# Altium schematic sheet JacdacMicroBitBackPackHi-Atl1 119.SchDoc: Complete design
size A4; DocumentNumber: 1; SheetNumber: 1; SheetTotal: 1; VersionControl_RevNumber: 1
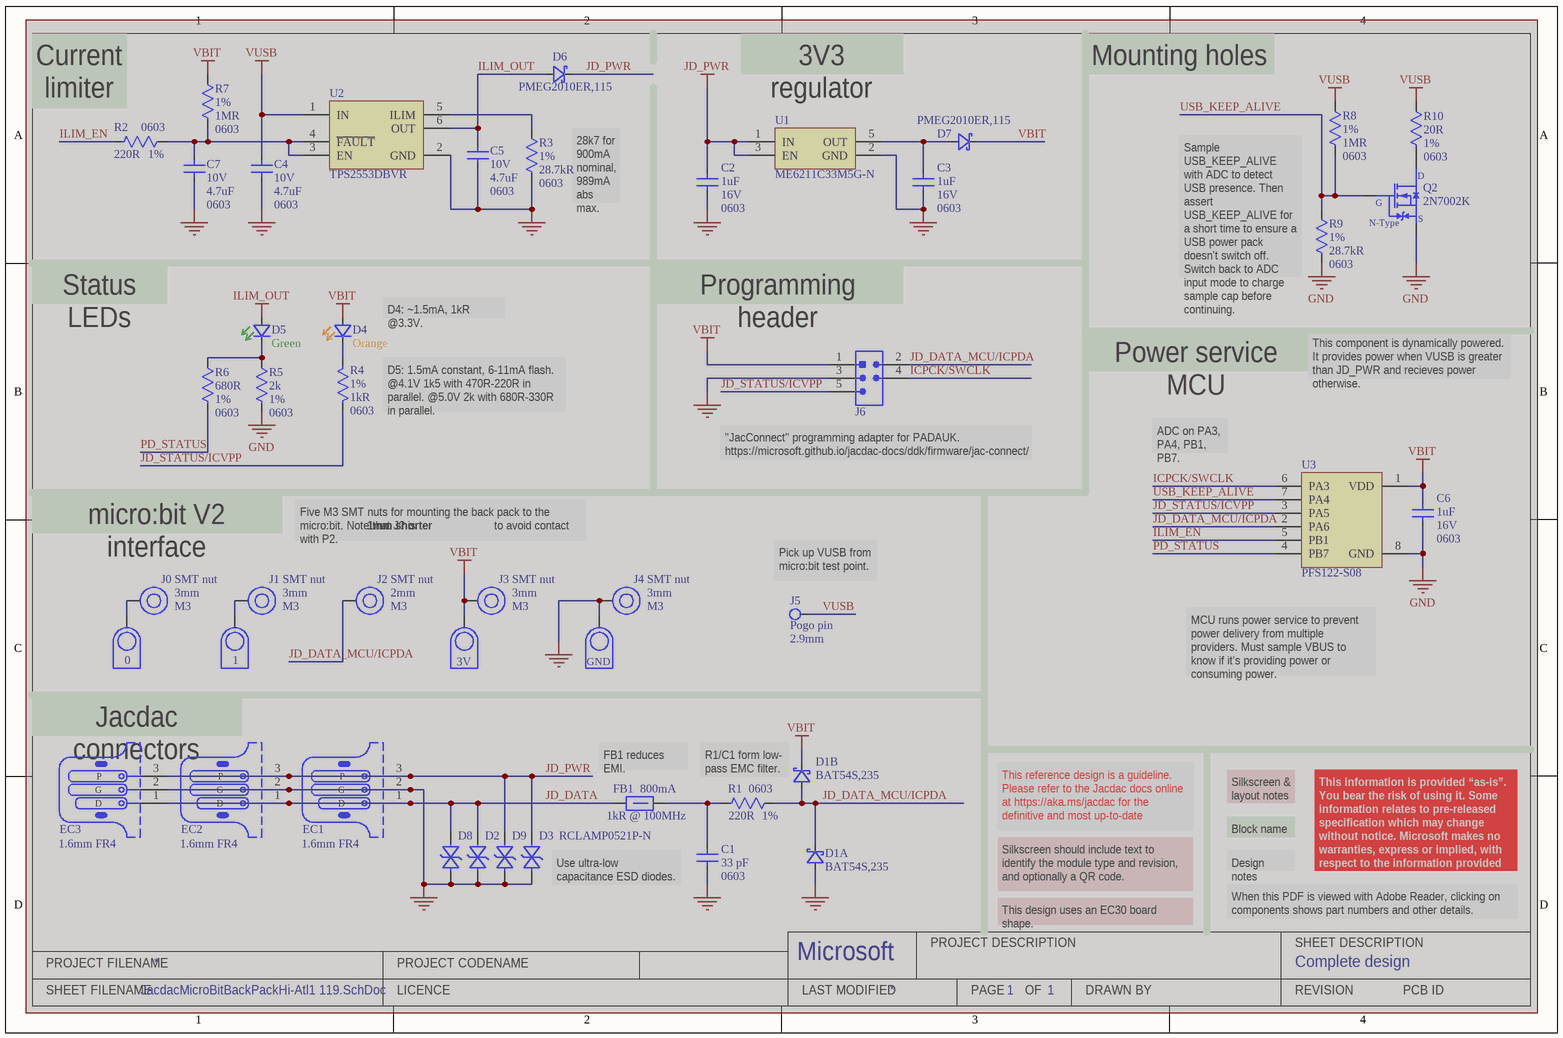
[diagram p0: JacdacMicroBitBackPackHi-Atl1 119.SchDoc]

## Parts
C1  33 pF  Case/Package: 0603  [CC0603]  (masked out: inside a compile mask, not in the netlist)
C2  Voltage: 16V  Case/Package: 0603  Capacitance: 1uF  [C0603 - without outline]  (hidden comment: 1uF 16V)  (masked out: inside a compile mask, not in the netlist)
C3  Voltage: 16V  Case/Package: 0603  Capacitance: 1uF  [C0603 - without outline]  (hidden comment: 1uF 16V)  (masked out: inside a compile mask, not in the netlist)
C4  Voltage Rating: 10V  Capacitance: 4.7uF  Case Code (Imperial): 0603  [C0603 - without outline]  (hidden comment: CL10A475KP8NNNC)  (masked out: inside a compile mask, not in the netlist)
C5  Voltage Rating: 10V  Capacitance: 4.7uF  Case Code (Imperial): 0603  [C0603 - without outline]  (hidden comment: CL10A475KP8NNNC)  (masked out: inside a compile mask, not in the netlist)
C6  Voltage: 16V  Case/Package: 0603  Capacitance: 1uF  [C0603 - without outline]  (hidden comment: 1uF 16V)  (masked out: inside a compile mask, not in the netlist)
C7  Voltage Rating: 10V  Capacitance: 4.7uF  Case Code (Imperial): 0603  [C0603 - without outline]  (hidden comment: CL10A475KP8NNNC)  (masked out: inside a compile mask, not in the netlist)
D1  Manufacturer Part Number: BAT54S,235  [NXP-BAT54S-TO-236AB - without outline]  (hidden comment: BAT54S)  (parts A,B of 2)  (masked out: inside a compile mask, not in the netlist)
D2  RCLAMP0521P-N  [TVS 0402 - XL]  (value not drawn)  (masked out: inside a compile mask, not in the netlist)
D3  RCLAMP0521P-N  [TVS 0402 - XL]  (masked out: inside a compile mask, not in the netlist)
D4  Colour: Orange  [0603 Orange]  (hidden comment: 19-217/S2C-AQ1R1B/3T)  (masked out: inside a compile mask, not in the netlist)
D5  Colour: Green  [0603 Green]  (hidden comment: 19-217/GHC-YR1S2/3T)  (masked out: inside a compile mask, not in the netlist)
D6  PMEG2010ER,115  [SOD-123W]  (masked out: inside a compile mask, not in the netlist)
D7  PMEG2010ER,115  [SOD-123W]  (masked out: inside a compile mask, not in the netlist)
D8  RCLAMP0521P-N  [TVS 0402 - XL]  (value not drawn)  (masked out: inside a compile mask, not in the netlist)
D9  RCLAMP0521P-N  [TVS 0402 - XL]  (value not drawn)  (masked out: inside a compile mask, not in the netlist)
EC1  PCB Type: 1.6mm FR4  [JACDAC_EDGE_CONNECTOR_NO_TRACES]  (hidden comment: 3 pin JACDAC edge connector)  (no BOM)  (masked out: inside a compile mask, not in the netlist)
EC2  PCB Type: 1.6mm FR4  [JACDAC_EDGE_CONNECTOR_NO_TRACES]  (hidden comment: 3 pin JACDAC edge connector)  (no BOM)  (masked out: inside a compile mask, not in the netlist)
EC3  PCB Type: 1.6mm FR4  [JACDAC_EDGE_CONNECTOR_NO_TRACES]  (hidden comment: 3 pin JACDAC edge connector)  (no BOM)  (masked out: inside a compile mask, not in the netlist)
FB1  Current Rating: 800mA  Impedance: 1kR @ 100MHz  [TDK MPZ1608 0.8mm - without outline]  (hidden comment: TDK MPZ1608S102ATA00)  (masked out: inside a compile mask, not in the netlist)
J0  SMT nut  Standoff Height: 3mm  Diameter: M3  [SMTSO-M3-3ET]  (masked out: inside a compile mask, not in the netlist)
J1  SMT nut  Standoff Height: 3mm  Diameter: M3  [SMTSO-M3-3ET]  (masked out: inside a compile mask, not in the netlist)
J2  SMT nut  Standoff Height: 2mm  Diameter: M3  [SMTSO-M3-2ET]  (masked out: inside a compile mask, not in the netlist)
J3  SMT nut  Standoff Height: 3mm  Diameter: M3  [SMTSO-M3-3ET]  (masked out: inside a compile mask, not in the netlist)
J4  SMT nut  Standoff Height: 3mm  Diameter: M3  [SMTSO-M3-3ET]  (masked out: inside a compile mask, not in the netlist)
J5  Pogo pin  Working Height: 2.9mm  [HARWIN-P70-1000045R]  (masked out: inside a compile mask, not in the netlist)
J6  Hack Connect Mini 1.27 mm pitch 2-row  [HACK_CONNECT_MINI_5_X_1_27_0.559mm_TH]  (value not drawn)  (no BOM)  (masked out: inside a compile mask, not in the netlist)
J10  micro:bit ring hole  [Microbit_V2_Edge_Connector_Ring_P0]  (value not drawn)  (no BOM)  (masked out: inside a compile mask, not in the netlist)
J11  micro:bit ring hole  [Microbit_V2_Edge_Connector_Ring_P1]  (value not drawn)  (no BOM)  (masked out: inside a compile mask, not in the netlist)
J13  micro:bit ring hole  [Microbit_V2_Edge_Connector_Ring_GND]  (value not drawn)  (no BOM)  (masked out: inside a compile mask, not in the netlist)
J14  micro:bit ring hole  [Microbit_V2_Edge_Connector_Ring_3V]  (value not drawn)  (no BOM)  (masked out: inside a compile mask, not in the netlist)
Q2  2N7002K  [SOT23-ONS]  (masked out: inside a compile mask, not in the netlist)
R1  Tolerance: 1%  Case/Package: 0603  [RC0603]  (hidden comment: 220R)  (masked out: inside a compile mask, not in the netlist)
R2  Tolerance: 1%  Case/Package: 0603  [RC0603]  (hidden comment: 220R)  (masked out: inside a compile mask, not in the netlist)
R3  Tolerance: 1%  Resistance: 28.7kR  Case/Package: 0603  [RC0603]  (hidden comment: 28.7k)  (masked out: inside a compile mask, not in the netlist)
R4  Tolerance: 1%  Resistance: 1kR  Case/Package: 0603  [RC0603]  (hidden comment: 1k)  (masked out: inside a compile mask, not in the netlist)
R5  2k  Tolerance: 1%  Case/Package: 0603  [RC0603-M]  (masked out: inside a compile mask, not in the netlist)
R6  680R  Tolerance: 1%  Case/Package: 0603  [RC0603-M]  (masked out: inside a compile mask, not in the netlist)
R7  Tolerance: 1%  Resistance: 1MR  Case/Package: 0603  [RC0603-M]  (hidden comment: 1M)  (masked out: inside a compile mask, not in the netlist)
R8  Tolerance: 1%  Resistance: 1MR  Case/Package: 0603  [RC0603-M]  (hidden comment: 1M)  (masked out: inside a compile mask, not in the netlist)
R9  Tolerance: 1%  Resistance: 28.7kR  Case/Package: 0603  [RC0603]  (hidden comment: 28.7k)  (masked out: inside a compile mask, not in the netlist)
R10  Resistance: 20R  Tolerance: 1%  Case Code (Imperial): 0603  [RC0603]  (hidden comment: RC0603FR-0720RL)  (masked out: inside a compile mask, not in the netlist)
U1  ME6211C33M5G-N  [MICRONE-SOT23-5]  (masked out: inside a compile mask, not in the netlist)
U2  TPS2553DBVR  [TI-TPS2553 - without_outline]  (masked out: inside a compile mask, not in the netlist)
U3  PFS122-S08  [SOP-8]  (masked out: inside a compile mask, not in the netlist)

## Notes on the sheet
- (near R2) Current limiter
- 3V3 regulator
- Mounting holes
- 28k7 for 900mA nominal,
  989mA abs max.
- Status LEDs
- D4: ~1.5mA, 1kR @3.3V.
- Programming header
- Sample USB_KEEP_ALIVE with ADC to detect USB presence. Then assert USB_KEEP_ALIVE for a short time to ensure a USB power pack doesn't switch off. Switch back to ADC input mode to charge sample cap before continuing.
- Power service MCU
- This component is dynamically powered. It provides power when VUSB is greater than JD_PWR and recieves power otherwise.
- D5: 1.5mA constant, 6-11mA flash. @4.1V 1k5 with 470R-220R in parallel. @5.0V 2k with 680R-330R in parallel.
- ADC on PA3, PA4, PB1, PB7.
- (near J6) "JacConnect" programming adapter for PADAUK.
  https://microsoft.github.io/jacdac-docs/ddk/firmware/jac-connect/
- micro:bit V2 interface
- Five M3 SMT nuts for mounting the back pack to the micro:bit. Note that J? is                         to avoid contact with P2.
- 1mm shorter
- (near J5) Pick up VUSB from micro:bit test point.
- MCU runs power service to prevent power delivery from multiple providers. Must sample VBUS to know if it's providing power or consuming power.
- Jacdac connectors
- (near FB1) FB1 reduces EMI.
- (near D1) R1/C1 form low- pass EMC filter.
- This reference design is a guideline. Please refer to the Jacdac docs online at https://aka.ms/jacdac for the definitive and most up-to-date information.
- Block name
- Silkscreen & layout notes
- Use ultra-low capacitance ESD diodes.
- This design uses an EC30 board shape.
- Silkscreen should include text to identify the module type and revision, and optionally a QR code.
- D1 clamps JD_DATA to protect MCU.
- Design notes
- When this PDF is viewed with Adobe Reader, clicking on components shows part numbers and other details.
- This information is provided “as-is”. You bear the risk of using it. Some information relates to pre-released specification which may change without notice. Microsoft makes no warranties, express or implied, with respect to the information provided here.
- PROJECT FILENAME
- PROJECT CODENAME
- Microsoft
- PROJECT DESCRIPTION
- SHEET DESCRIPTION
- SHEET FILENAME
- LICENCE
- LAST MODIFIED
- PAGE
- OF
- DRAWN BY
- REVISION
- PCB ID
- (in symbol 2N7002K) N-Type
- (in symbol micro:bit edge connector ring 3V) 3V
- (in symbol micro:bit edge connector ring GND) GND
- (in symbol micro:bit edge connector ring P0) 0

## Library data of the parts
C1 = CC0603JRNPO9BN330: 33pF 0603 100V C0G/NPO; Manufacturer: Yageo; Dielectric: C0G; Tolerance: 5%; Supplier 1: Digi-Key; Manufacturer Part Number: CC0603JRNPO9BN330; RoHS: Yes; Category: Ceramic Capacitors; Mount: Surface Mount; Weight: 7.1E-05oz; Case Code (Imperial): 0603; Case Code (Metric): 1608; Min Operating Temperature: -55°C; Max Operating Temperature: 125°C; Capacitance: 33pF; Termination: SMD/SMT; Composition: Ceramic; Packaging: Tape and Reel; Voltage Rating: 100V; Voltage Rating (DC): 100V; Length: 1.6mm; Height: 0.8mm; Thickness: 0.035inch; Depth: 0.8mm; Width: 0.8mm; Lead Free: Lead Free; ComponentLink1URL: https://datasheet.ciiva.com/13207/upy-gp-np0-16v-to-50v-8-13207786.pdf; ComponentLink1Description: Online datasheet; Manufacturer 1: Yageo; Manufacturer Part Number 1: CC0603JRNPO9BN330
C2 C3 C6 = CL10A105KO8NNNC: SMD Multilayer Ceramic Capacitor, 1 µF, 16 V, 0603 [1608 Metric], ± 10%, X5R, CL Series; Manufacturer: Samsung; ComponentLink1URL: https://datasheet.lcsc.com/lcsc/1811021622_Samsung-Electro-Mechanics-CL10A105KO8NNNC_C1592.pdfq; ComponentLink1Description: Online datasheet; Supplier 1: Digi-Key; Manufacturer Part Number: CL10A105KO8NNNC; RoHS: Yes; Category: Ceramic Capacitors; Stock 1: 3575337; Pricing 1: 1=0.10000, 10=0.03600, 50=0.01960, 100=0.01600, 500=0.01144, 1000=0.00898 (USD); Mount: Surface Mount; Case Code (Metric): 1608; Case Code (Imperial): 0603; Material: Ceramic; Contact Plating: Tin; Min Operating Temperature: -55°C; Max Operating Temperature: 85°C; Tolerance: 10%; Package Quantity: 1; Packaging: Tape and Reel; Voltage Rating: 16V; Dielectric: X5R; Voltage Rating (DC): 16V; Series: CL; Construction: Flat; Length: 1.6mm; Width: 0.031inch; Height: 0.8mm; Thickness: 0.035inch; Depth: 0.8mm; Radiation Hardening: No; Lead Free: Lead Free; RoHS Compliant: Yes; Supplier 2: Farnell; Supplier 3: RSComponents; Supplier 4: Mouser; Supplier Part Number 1: 1276-1034-1-ND; Supplier Part Number 2: 3013384; Supplier Part Number 3: 7664780; Supplier Part Number 4: 187-CL10A105KO8NNNC; Supplier 5: LCSC; Supplier Part Number 5: C1592; Manufacturer 1: Samsung; Manufacturer Part Number 1: CL10A105KO8NNNC
C4 C5 C7 = CL10A475KP8NNNC: CAP CER 4.7UF 10V X5R 0603; Manufacturer: Samsung; Tolerance: 10%; Supplier 1: Farnell; Manufacturer Part Number: CL10A475KP8NNNC; RoHS: Yes; Category: Ceramic Capacitors; Stock 1: 75690; Pricing 1: 10=0.02700, 100=0.02160, 500=0.01580, 1000=0.01310, 2000=0.01130 (GBP); Mount: Surface Mount; Case/Package: 0603; Case Code (Metric): 1608; Contact Plating: Tin; Min Operating Temperature: -55°C; Max Operating Temperature: 85°C; Dielectric: X5R; Package Quantity: 1; Packaging: Tape and Reel; Series: CL; Construction: Flat; Length: 1.6mm; Width: 0.031inch; Height: 0.8mm; Thickness: 0.035inch; Depth: 0.8mm; Radiation Hardening: No; RoHS Compliant: Yes; ComponentLink1URL: https://datasheet.ciiva.com/25797/cl10a475kp8nnnc-25797520.pdf; ComponentLink1Description: Online datasheet; Supplier 2: Digi-Key; Pricing 2: 1=0.10000, 10=0.04900, 50=0.02680, 100=0.02180, 500=0.01558, 1000=0.01224 (USD); Supplier Part Number 2: 1276-1044-1-ND; Supplier Part Number 1: 3013398; Created By: D Gakure; Checked By: ?
D1 = BAT54S: DIODE ARRAY SCHOTTKY 30V SOT23; Manufacturer: Nexperia; Supplier 1: Digi-Key; RoHS: No; Category: Rectifier Diodes; Stock 1: 14011; Pricing 1: 1=0.13000, 10=0.11900, 100=0.05610, 500=0.03326, 1000=0.02185, 5000=0.02138 (USD); ComponentLink1URL: https://assets.nexperia.com/documents/data-sheet/BAT54_SER.pdf; ComponentLink1Description: NXP datasheet online; Supplier 2: Mouser; Supplier 3: RSComponents; Supplier Part Number 2: 771-BAT54S235; Supplier Part Number 3: 1707990; Supplier Part Number 1: 1727-1868-1-ND; Manufacturer 1: Nexperia; Manufacturer Part Number 1: BAT54S,235
D2 D3 D8 D9 = RCLAMP0521P-N: Bidirectional 5V (Max) 6V 16V 3.5A (8/20us) 0402 TVS RoHS; Manufacturer: Born Semiconductor; Package: 0402; Created By: D Gakure; Checked By: ?; Supplier1: LCSC; Supplier1 Part Number: C316043; ComponentLink1Description: Online datasheet; ComponentLink1URL: https://datasheet.lcsc.com/szlcsc/Bourne-Semicon-Shenzhen-RCLAMP0521P-N_C316043.pdf; Manufacturer Part Number: RCLAMP0521P-N; Manufacturer 1: Born Semiconductor; Manufacturer Part Number 1: RCLAMP0521P-N
D4 = 19-217/S2C-AQ1R1B/3T: LED ORANGE DIFFUSED 0603 SMD; Manufacturer: Everlight Elec; Manufacturer Part Number: 19-217/S2C-AQ1R1B/3T; Mount: Surface Mount; Case/Package: 0603; Color: Orange; Case Code (Imperial): 0603; ComponentLink1URL: https://datasheet.lcsc.com/lcsc/1912171731_Everlight-Elec-19-217-S2C-AQ1R1B-3T_C146215.pdf; ComponentLink1Description: Online datasheet; Supplier 1: LCSC; Supplier 1 Part Number: C146215
D5 = 19-217/GHC-YR1S2/3T: LED GREEN DIFFUSED 0603 SMD; Manufacturer: Everlight Elec; Manufacturer Part Number: 19-217/GHC-YR1S2/3T; Mount: Surface Mount; Case/Package: 0603; Color: Green; Case Code (Imperial): 0603; ComponentLink1URL: https://datasheet.lcsc.com/lcsc/1811101510_Everlight-Elec-19-217-GHC-YR1S2-3T_C72043.pdf; ComponentLink1Description: Online datasheet; Supplier 1: LCSC; Supplier 1 Part Number: C72043
D6 D7 = PMEG2010ER,115: NEXPERIA - PMEG2010ER,115 - DIODE, RECT SCH, 20V, 1A, SOD123W; Supplier 1: Digi-Key; Manufacturer: Nexperia; RoHS: Yes; Stock 1: 722; Pricing 1: 1=0.42000, 10=0.31300, 100=0.19480, 500=0.13328, 1000=0.10252 (USD); RoHS Compliant: Yes; ComponentLink1URL: http://www.farnell.com/datasheets/1383341.pdf; ComponentLink1Description: Online datasheet; Supplier 2: Future Electronics; Stock 2: 144000; Pricing 2: 3000=0.20000, 6000=0.16300, 9000=0.16200, 12000=0.16100, 15000=0.16000 (USD); Supplier 3: RSComponents; Stock 3: 1; Pricing 3: 50=0.32100, 100=0.26700, 250=0.21200, 500=0.11100, 1000=0.08200 (USD); Supplier 4: Mouser; Stock 4: 2146; Pricing 4: 1=0.37000, 10=0.25700, 50=0.25700, 100=0.13400, 1000=0.09400, 10000=0.07200 (USD); Supplier 5: Farnell; Stock 5: 24250; Pricing 5: 5=0.40400, 10=0.27600, 100=0.13400, 500=0.11500, 1000=0.07750 (GBP); Supplier Part Number 5: 1907681; Supplier Part Number 4: 771-PMEG2010ER115; Supplier Part Number 3: 8166824P; Supplier Part Number 2: 4222907; Supplier Part Number 1: 1727-5192-1-ND; Manufacturer Part Number: PMEG2010ER,115
EC1-EC3 = Jacdac edge connector: 3 pin Jacdac edge connector 1.27mm pitch; Manufacturer Part Number: JACDAC_EDGE_CONNECTOR; Checked By: ?; Created By: D. Gakure; ComponentLink1Description: Yuliang JACDAC cable connector drawing online; ComponentLink1URL: https://github.com/microsoft/jacdac-mdk/blob/main/connector/JACDAC-Connector-by-Yuliang-2020-11-28.pdf; ComponentLink2Description: JACDAC PCB edge connector spec onlin; ComponentLink2URL: https://github.com/microsoft/jacdac-mdk/blob/main/connector/JACDAC_PCB_Edge_Connector_Drawing_JD-PEC-01_rev_01.pdf
FB1 = TDK MPZ1608S102ATA00: 0603 1k@100MHz 0.8A chip; Core Material: Ferrite; Tolerance: 25%; DC Resistance (DCR): 300mR; Supplier 1: Digi-Key; Stock 1: 113542; Pricing 1: 1=0.1, 10=0.079, 25=0.0716, 50=0.0644, 100=0.0472, 250=0.03432, 500=0.03146, 1000=0.02717 (USD); Mount: Surface Mount; Case/Package: 0603; Case Code (Metric): 1608; Case Code (Imperial): 0603; Package Quantity: 4000; Packaging: Tape and Reel; Max DC Current: 800mA; Length: 0.063inch; Height: 0.037inch; Width: 0.031inch; ComponentLink2URL: https://www.mouser.co.uk/datasheet/2/400/eads_commercial_power_mpz1608_en-923650.pdf; ComponentLink2Description: datasheet online; Supplier 2: Mouser; ComponentLink3Description: datasheet; ComponentLink3URL: Y:\System\Altium\Libraries 2014\TDK\Datasheets\eads_commercial_power_mpz1608_en-923650.pdf; Supplier Part Number 1: 445-8694-1-ND; Supplier Part Number 2: 810-MPZ1608S102ATA00; Manufacturer: TDK; Manufacturer Part Number: MPZ1608S102ATA00; Manufacturer 1: TDK; Manufacturer Part Number 1: MPZ1608S102ATA00
J0 J1 J3 J4 = SMTSO-M3-3ET: Standoff Round Swage F/F M3 X 0.5-THD Carbon Steel Electro-Tin ASTM B545 Automotive; Manufacturer 1: PennEngineering; Supplier 1: Mouser; Manufacturer Part Number 1: SMTSO-M3-3ET; RoHS: No; Supplier Part Number 1: 153-SMTSO-M3-3ET; Manufacturer: PennEngineering; Manufacturer Part Number: SMTSO-M3-3ET
J2 = SMTSO-M3-2ET: Standoff Round Swage F/F M3 X 0.5-THD Carbon Steel Electro-Tin ASTM B545 Automotive; Manufacturer 1: PennEngineering; Supplier 1: Mouser; Manufacturer Part Number 1: SMTSO-M3-2ET; RoHS: No; Supplier Part Number 1: 153-SMTSO-M3-2ET; Manufacturer: PennEngineering; Manufacturer Part Number: SMTSO-M3-2ET
J5 = HARWIN-P70-1000045R: Spring Loaded Contact, Pin, 2.9mm, SMT; Manufacturer 1: Harwin; Plating: Gold; Current Rating: 2A; Supplier 1: Digi-Key; Manufacturer Part Number 1: P70-1000045R; RoHS: Yes; Category: Connectors; Stock 1: 1152; Pricing 1: 1=1.02000, 10=0.85900, 25=0.82400, 50=0.80660, 100=0.77150, 250=0.70140, 500=0.63126 (USD); Mount: Surface Mount; Material: Brass; REACH SVHC: No SVHC; RoHS Compliant: Yes; ComponentLink1URL: https://cdn.harwin.com/pdfs/P70-10X.pdf; ComponentLink1Description: Harwin drawing online; ComponentLink2URL: http://www.farnell.com/datasheets/2151575.pdf; ComponentLink2Description: Harwin catalogue page online; Manufacturer Part Number: P70-1000045R; Manufacturer: Harwin; Supplier Part Number 1: 952-3127-1-ND; Supplier 2: Farnell; Supplier 3: Mouser; Supplier Part Number 2: 2664910; Supplier Part Number 3: 855-P70-1000045R; Length: 3.5mm
J6 = HACK_CONNECT_MINI
J10 = micro:bit edge connector ring P0: One ring like those on the micro:bit edge connector, designed to take a 4mm banana plug
J11 = micro:bit edge connector ring P1: One ring like those on the micro:bit edge connector, designed to take a 4mm banana plug
J13 = micro:bit edge connector ring GND: One ring like those on the micro:bit edge connector, designed to take a 4mm banana plug
J14 = micro:bit edge connector ring 3V: One ring like those on the micro:bit edge connector, designed to take a 4mm banana plug
Q2 = 2N7002K: MOSFET Transistor, N Channel, 300 mA, 60 V, 2 ohm, 10 V, 2.5 V; Manufacturer: ON Semiconductor / Fairchild; Max Power Dissipation: 350mW; Continuous Drain Current (ID): 300mA; Input Capacitance: 50pF; Number of Elements: 1; Rds On Max: 2R; Drain to Source Breakdown Voltage: 60V; Threshold Voltage: 2.5V; Element Configuration: Single; Gate to Source Voltage (Vgs): 20V; Turn-Off Delay Time: 30ns; Turn-On Delay Time: 5ns; Polarity: N-CHANNEL; Supplier 1: Digi-Key; Stock 1: 53564; Pricing 1: 1=0.40000, 10=0.32500, 25=0.27240, 100=0.17240, 500=0.11344, 1000=0.07714 (USD); Case/Package: SOT-23; Number of Pins: 3; Contact Plating: Tin,Matte; Min Operating Temperature: -55°C; Max Operating Temperature: 150°C; Packaging: Tape and Reel; Power Dissipation: 350mW; Package Quantity: 1; Drain to Source Resistance: 2R; On-State Resistance: 2R; Length: 2.92mm; Height: 1.2mm; Width: 1.3mm; Radiation Hardening: No; Lead Free: Lead Free; REACH SVHC: No SVHC; Supplier 2: Mouser; ComponentLink1Description: Online datasheet; ComponentLink1URL: https://www.onsemi.com/pdf/datasheet/2n7002k-d.pdf; Supplier Part Number 2: 512-2N7002K; Supplier Part Number 1: 2N7002KCT-ND; Manufacturer Part Number: 2N7002K; Supplier 3: Farnell; Supplier Part Number 3: 2453382; Category: MOSFETs; Checked By: ?; Created By: D. Gakure; Drain-source On Resistance-Max: 2R; Drain to Source Voltage (Vdss): 60V; Mount: Surface Mount; Pricing 2: 1=0.40000, 10=0.27300, 50=0.27300, 100=0.13400, 1000=0.07800, 10000=0.05100 (USD); Pricing 3: 5=0.34800, 10=0.23500, 100=0.09100, 500=0.05850, 3000=0.04630, 9000=0.03860, 24000=0.03750, 45000=0.03530 (GBP); RoHS: Yes; Stock 2: 111825; Stock 3: 101059; Voltage: 60V
R1 R2 = RC0603FR-07220RL: Res Thick Film 0603 220 Ohm 1% 0.1W(1/10W) ±100ppm/°C Pad SMD T/R; Manufacturer 1: Yageo; Voltage Rating (DC): 50V; Power Rating: 100mW; ComponentLink4URL: https://datasheet.ciiva.com/46395/443971-46395002.pdf; ComponentLink4Description: online datasheet; Supplier 1: Digi-Key; Manufacturer Part Number 1: RC0603FR-07220RL; RoHS: Yes; Category: Chip SMD Resistors; Stock 1: 1257522; Pricing 1: 1=0.10000, 10=0.02300, 100=0.00930, 1000=0.00417, 2500=0.00362 (USD); Number of Pins: 2; Case Code (Imperial): 0603; Case Code (Metric): 1608; Size Code: 0603; Min Operating Temperature: -55°C; Max Operating Temperature: 155°C; Resistor Type: Thick Film; Temperature Coefficient: 100ppm/°C; Packaging: Tape and Reel; Voltage Rating: 50V; Package Quantity: 1; Termination: SMD/SMT; Number of Terminations: 2; Max Power Dissipation: 100mW; Features: Moisture Resistant; Series: RC; Resistance Tolerance: 1%; Construction: Rectangular; Length: 1.6mm; Width: 0.031inch; Height: 0.022inch; Depth: 0.8mm; REACH SVHC: No SVHC; Lead Free: Lead Free; RoHS Compliant: Yes; Military Standard: Not; Supplier 2: Farnell; Supplier 3: Mouser; Supplier 4: RSComponents; Supplier Part Number 2: 2421863; Supplier Part Number 3: 603-RC0603FR-07220RL; Supplier Part Number 4: 1995497; Supplier Part Number 1: 311-220HRCT-ND; Manufacturer: Yageo; Manufacturer Part Number: RC0603FR-07220RL; Resistance: 220R
R3 R9 = RC0603FR-0728K7L: Res Thick Film 0603 28.7k Ohm 1% 0.1W(1/10W) ±100ppm/C Pad SMD T/R; Manufacturer 1: Yageo; Voltage Rating: 50V; Power Rating: 100mW; Temperature Coefficient: 100ppm/°C; Supplier 1: Digi-Key; Manufacturer Part Number 1: RC0603FR-0728K7L; RoHS: Yes; Category: Chip SMD Resistors; Stock 1: 276730; Pricing 1: 1=0.10000, 10=0.02300, 100=0.00930, 1000=0.00417, 2500=0.00362 (USD); Mount: Surface Mount; Case Code (Imperial): 0603; Case Code (Metric): 1608; Size Code: 0603; Min Operating Temperature: -55°C; Max Operating Temperature: 155°C; Packaging: Tape and Reel; Package Quantity: 1; Resistor Type: Thick Film; Termination: SMD/SMT; Number of Terminations: 2; Max Power Dissipation: 100mW; Voltage Rating (DC): 50V; Features: Moisture Resistant; Series: RC; Construction: Rectangular; Technology: THICK FILM; Length: 1.6mm; Width: 0.031inch; Height: 0.022inch; Depth: 0.8mm; Military Standard: Not; Lead Free: Lead Free; RoHS Compliant: Yes; ComponentLink5URL: https://datasheet.ciiva.com/2553/pyu-r-int-thick-7-2553533.pdf; ComponentLink5Description: onilne datasheet; Manufacturer: Yageo; Manufacturer Part Number: RC0603FR-0728K7L; Supplier 2: Farnell; Supplier 3: Mouser; Supplier 4: RSComponents; Supplier Part Number 1: 311-28.7KHRCT-ND; Supplier Part Number 2: 3951071; Supplier Part Number 3: 603-RC0603FR-0728K7L; Supplier Part Number 4: 505-1003
R4 = RC0603FR-071KL: Res Thick Film 0603 1K Ohm 1% 1/10W ±100ppm/°C Molded SMD SMD Paper T/R; Manufacturer: Yageo; Power Rating: 100mW; Voltage Rating: 50V; ComponentLink4URL: https://datasheet.ciiva.com/46395/443971-46395002.pdf; ComponentLink4Description: online datasheet; Manufacturer Part Number: RC0603FR-071KL; Supplier 1: Digi-Key; Manufacturer 1: Yageo; Manufacturer Part Number 1: RC0603FR-071KL; RoHS: Yes; Category: Chip SMD Resistors; Stock 1: 7298696; Pricing 1: 1=0.10000, 10=0.02300, 100=0.00930, 1000=0.00417, 2500=0.00362 (USD); Contact Plating: Tin,Matte; Case Code (Imperial): 0603; Case Code (Metric): 1608; Size Code: 0603; Min Operating Temperature: -55°C; Max Operating Temperature: 155°C; Temperature Coefficient: 100ppm/°C; Resistor Type: Thick Film; Packaging: Tape and Reel; Termination: SMD/SMT; Features: Moisture Resistant; Series: RC; Max Power Dissipation: 100mW; Number of Terminations: 2; Technology: THICK FILM; Resistance Tolerance: 1%; Construction: Rectangular; Length: 1.6mm; Height: 0.45mm; Depth: 0.8mm; Radiation Hardening: No; REACH SVHC: No SVHC; Lead Free: Lead Free; Military Standard: Not; RoHS Compliant: Yes; Supplier 2: Farnell; Supplier 3: Mouser; Supplier 4: RSComponents; Supplier Part Number 1: 311-1.00KHRCT-ND; Supplier Part Number 2: 2421849; Supplier Part Number 3: 603-RC0603FR-071KL; Supplier Part Number 4: 1995478
R5 = RC0603FR-072KL: Res Thick Film 0603 2k Ohm 1% 0.1W(1/10W) ±100ppm/C Pad SMD T/R; Manufacturer 1: Yageo; Voltage Rating: 50V; Power Rating: 100mW; Temperature Coefficient: 100ppm/°C; Resistance: 2kR; Manufacturer Part Number 1: RC0603FR-072KL; RoHS: Yes; Category: Chip SMD Resistors; Mount: Surface Mount; Case Code (Imperial): 0603; Case Code (Metric): 1608; Size Code: 0603; Min Operating Temperature: -55°C; Max Operating Temperature: 155°C; Packaging: Tape and Reel; Package Quantity: 1; Resistor Type: Thick Film; Termination: SMD/SMT; Number of Terminations: 2; Max Power Dissipation: 100mW; Voltage Rating (DC): 50V; Features: Moisture Resistant; Series: RC; Construction: Rectangular; Technology: THICK FILM; Length: 1.6mm; Width: 0.031inch; Height: 0.022inch; Depth: 0.8mm; Military Standard: Not; Lead Free: Lead Free; RoHS Compliant: Yes; ComponentLink5URL: https://datasheet.ciiva.com/2553/pyu-r-int-thick-7-2553533.pdf; ComponentLink5Description: onilne datasheet; Manufacturer: Yageo; Manufacturer Part Number: RC0603FR-072KL; Supplier 1: Digi-Key; Supplier 2: Farnell; Supplier 3: Mouser; Supplier 4: RSComponents; Supplier Part Number 1: 311-2.00KHRCT-ND; Supplier Part Number 2: 3495801; Supplier Part Number 3: 603-RC0603FR-072KL; Supplier Part Number 4: 1995524
R6 = RC0603FR-07680RL: Res Thick Film 0603 680 Ohm 1% 0.1W(1/10W) ±100ppm/C Pad SMD T/R; Manufacturer 1: Yageo; Voltage Rating: 50V; Power Rating: 100mW; Temperature Coefficient: 100ppm/°C; Manufacturer Part Number 1: RC0603FR-07680RL; RoHS: Yes; Category: Chip SMD Resistors; Mount: Surface Mount; Case Code (Imperial): 0603; Case Code (Metric): 1608; Size Code: 0603; Min Operating Temperature: -55°C; Max Operating Temperature: 155°C; Packaging: Tape and Reel; Package Quantity: 1; Resistor Type: Thick Film; Termination: SMD/SMT; Number of Terminations: 2; Max Power Dissipation: 100mW; Voltage Rating (DC): 50V; Features: Moisture Resistant; Series: RC; Construction: Rectangular; Technology: THICK FILM; Length: 1.6mm; Width: 0.031inch; Height: 0.022inch; Depth: 0.8mm; Military Standard: Not; Lead Free: Lead Free; RoHS Compliant: Yes; ComponentLink5URL: https://datasheet.ciiva.com/2553/pyu-r-int-thick-7-2553533.pdf; ComponentLink5Description: onilne datasheet; Manufacturer: Yageo; Manufacturer Part Number: RC0603FR-07680RL; Supplier 1: Digi-Key; Supplier 2: Farnell; Supplier 3: Mouser; Supplier 4: RSComponents; Supplier Part Number 1: 311-680HRCT-ND; Supplier Part Number 2: 9238468; Supplier Part Number 3: 603-RC0603FR-07680RL; Supplier Part Number 4: 1995618; Resistance: 680R
R7 R8 = RC0603FR-071ML: Res Thick Film 0603 1M Ohm 1% 0.1W(1/10W) ±100ppm/C Pad SMD T/R; Manufacturer 1: Yageo; Voltage Rating: 50V; Power Rating: 100mW; Temperature Coefficient: 100ppm/°C; Manufacturer Part Number 1: RC0603FR-071ML; RoHS: Yes; Category: Chip SMD Resistors; Mount: Surface Mount; Case Code (Imperial): 0603; Case Code (Metric): 1608; Size Code: 0603; Min Operating Temperature: -55°C; Max Operating Temperature: 155°C; Packaging: Tape and Reel; Package Quantity: 1; Resistor Type: Thick Film; Termination: SMD/SMT; Number of Terminations: 2; Max Power Dissipation: 100mW; Voltage Rating (DC): 50V; Features: Moisture Resistant; Series: RC; Construction: Rectangular; Technology: THICK FILM; Length: 1.6mm; Width: 0.031inch; Height: 0.022inch; Depth: 0.8mm; Military Standard: Not; Lead Free: Lead Free; RoHS Compliant: Yes; ComponentLink5URL: https://datasheet.ciiva.com/2553/pyu-r-int-thick-7-2553533.pdf; ComponentLink5Description: onilne datasheet; Manufacturer: Yageo; Manufacturer Part Number: RC0603FR-071ML; Supplier 1: Digi-Key; Supplier 2: Farnell; Supplier 3: Mouser; Supplier 4: RSComponents; Supplier Part Number 4: 1995481; Supplier Part Number 3: 603-RC0603FR-071ML; Supplier Part Number 2: 9238840; Supplier Part Number 1: 311-1.00MHRCT-ND
R10 = RC0603FR-0720RL: RES SMD 20 OHM 1% 1/10W 0603; Manufacturer: Yageo; Power Rating: 100mW; Voltage Rating: 50V; Temperature Coefficient: 100ppm/°C; Working Voltage: 75V; Supplier 1: Digi-Key; Manufacturer Part Number: RC0603FR-0720RL; RoHS: Yes; Category: Chip SMD Resistors; Stock 1: 2002412; Pricing 1: 1=0.10000, 10=0.02100, 100=0.00840, 1000=0.00379, 2500=0.00329 (USD); Case/Package: 0603; Case Code (Metric): 1608; Min Operating Temperature: -55°C; Max Operating Temperature: 155°C; Packaging: Tape and Reel; Package Quantity: 1; Termination: SMD/SMT; Resistor Type: Thick Film; Number of Terminations: 2; Max Power Dissipation: 100mW; Voltage Rating (DC): 50V; Features: Moisture Resistant; Series: RC; Construction: Rectangular; Technology: THICK FILM; Resistance Tolerance: 1%; Length: 1.6mm; Width: 0.8mm; Height: 0.45mm; Depth: 0.8mm; REACH SVHC: No SVHC; Military Standard: Not; Lead Free: Lead Free; RoHS Compliant: Yes; ComponentLink1URL: https://datasheet.ciiva.com/11819/0900766b80f96399-11819290.pdf; ComponentLink1Description: Online datasheet; Supplier 2: Mouser; Stock 2: 238682; Pricing 2: 1=0.10000, 10=0.01800, 50=0.01800, 100=0.00600, 1000=0.00500, 10000=0.00300 (USD); Supplier 3: Farnell; Stock 3: 229990; Pricing 3: 10=0.01820, 100=0.00650, 500=0.00550, 1000=0.00450, 2500=0.00390, 5000=0.00360, 25000=0.00330 (GBP); Created By: D. Gakure; Supplier Part Number 3: 3495766; Supplier Part Number 2: 603-RC0603FR-0720RL; Supplier Part Number 1: 311-20.0HRCT-ND
U1 = ME6211C33M5G-N: 6V 260mV @ 200mA(typ) - - Fixed 3.3V SOT-23-5 Linear Voltage Regulators (LDO) ROHS; manufacturer: MICRONE(Nanjing Micro One Elec); Output Current: 500mA; Output Configuration: Positive; Number of Regulators: 1; Max Input Voltage: 6; Dropout Voltage: 200mV; Supplier Part Number: C82942; Category: Voltage Regulators - Linear; Stock 1: 32529; Pricing 1: 1=0.33000, 10=0.24900, 25=0.21760, 100=0.12440, 250=0.11664, 500=0.09330, 1000=0.07153 (USD); Mount: Surface Mount; Case/Package: SOT-23-5; Supplier 1: LCSC; Output Type: Fixed; Min Output Voltage: 3.3V; ComponentLink3URL: https://datasheet.lcsc.com/lcsc/1811131510_MICRONE-Nanjing-Micro-One-Elec-ME6211C33M5G-N_C82942.pdf; ComponentLink3Description: On Semi datasheet online; Created: DG; Manufacturer Part Number: ME6211C33M5G-N; Manufacturer 1: MICRONE(Nanjing Micro One Elec); Manufacturer Part Number 1: ME6211C33M5G-N
U2 = TPS2553DBVR: IC PWR SWITCH N-CHAN 1:1 SOT23-6; Manufacturer: Texas Instruments; Number of Outputs: 1; Min Supply Voltage: 2.5V; Max Supply Voltage: 6.5V; On-State Resistance: 85mR; Output Current: 1.5A; Max Power Dissipation: 625mW; Supplier 1: Digi-Key; RoHS: Yes; Category: Hot Swap Controllers; Stock 1: 14713; Pricing 1: 1=1.20000, 10=1.07100, 25=1.01640, 100=0.78050, 250=0.68972, 500=0.65340, 1000=0.50820 (USD); Case/Package: SOT-23; Number of Pins: 6; Weight: 0.00127oz; Min Operating Temperature: -40°C; Max Operating Temperature: 85°C; Packaging: Tape and Reel; Package Quantity: 1; Max Input Voltage: 6.5V; Min Input Voltage: 2.5V; Radiation Hardening: No; Lead Free: Lead Free; REACH SVHC: No SVHC; ComponentLink1URL: https://datasheet.ciiva.com/15108/getdatasheetpartid-297517-15108509.pdf; ComponentLink1Description: Online datasheet; Supplier 2: Farnell; Supplier 3: Mouser; Supplier Part Number 3: 595-TPS2553DBVR; Supplier Part Number 2: 3124082; Supplier Part Number 1: 296-32464-1-ND; Manufacturer Part Number: TPS2553DBVR
U3 = PFS122-SO8: 8bit MTP MCU with 12-bit ADC; Manufacturer: PADAUK; ComponentLink1Description: Online datasheet; ComponentLink1URL: http://www.padauk.com.tw/upload/doc/PFS122%20datasheet_EN_V001_20220518.pdf; Package: SOP-8; Manufacturer Part Number: PFS122-S08